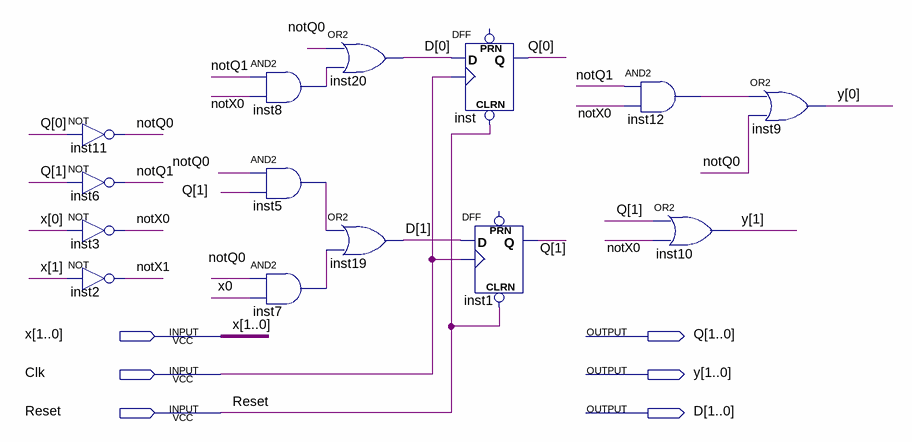
[diagram p0: schematic sheet]
// Quartus schematic Lab8_2.bdf as structural Verilog: 14 symbols, 6 pins
module Lab8_2 (
  input  [1:0] x,
  input  Clk,
  input  Reset,
  output [1:0] Q,
  output [1:0] y,
  output [1:0] D
);

  wire inst5_out, inst7_out, inst8_out, inst12_out, notQ0, notQ1, notX0, notX1;

  not inst11 (notQ0, Q[0]);
  not inst6 (notQ1, Q[1]);
  not inst3 (notX0, x[0]);
  not inst2 (notX1, x[1]);
  and inst8 (inst8_out, notQ1, notX0);
  and inst5 (inst5_out, notQ0, Q[1]);
  and inst7 (inst7_out, notQ0, x[0]);
  or inst20 (D[0], notQ0, inst8_out);
  or inst19 (D[1], inst5_out, inst7_out);
  DFF inst (.CLRN(Reset), .CLK(Clk), .D(D[0]), .Q(Q[0]));  // open: PRN
  DFF inst1 (.CLRN(Reset), .CLK(Clk), .D(D[1]), .Q(Q[1]));  // open: PRN
  and inst12 (inst12_out, notQ1, notX0);
  or inst10 (y[1], Q[1], notX0);
  or inst9 (y[0], inst12_out, notQ0);
endmodule
